# EAGLE schematic mod_panel_voltage (EAGLE 8.4.1)
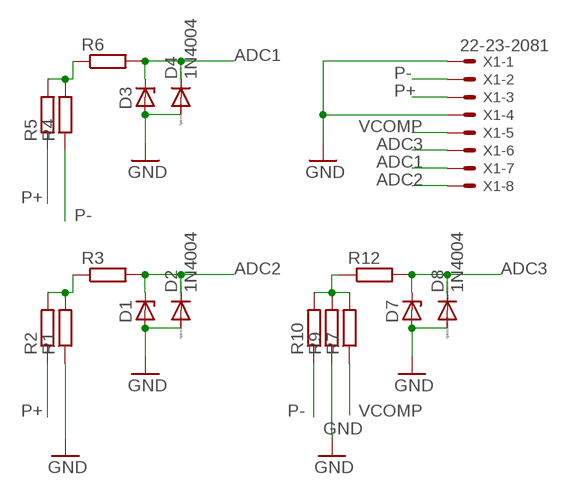
[diagram p0: schematic, sheet 1]

## Parts
D1  ZENER-DIODEDO34-7  [DO34Z7]
D2  1N4004  [DO41-10]
D3  ZENER-DIODEDO34-7  [DO34Z7]
D4  1N4004  [DO41-10]
D7  ZENER-DIODEDO34-7  [DO34Z7]
D8  1N4004  [DO41-10]
R1  R-EU_0204/5  [0204/5]
R2  R-EU_0204/5  [0204/5]
R3  R-EU_0204/5  [0204/5]
R4  R-EU_0204/5  [0204/5]
R5  R-EU_0204/5  [0204/5]
R6  R-EU_0204/5  [0204/5]
R7  R-EU_0204/5  [0204/5]
R9  R-EU_0204/5  [0204/5]
R10  R-EU_0204/5  [0204/5]
R12  R-EU_0204/5  [0204/5]
X1  22-23-2081  [22-23-2081]

## Nets
ADC1: D3.C D4.C R6.2 X1.7
ADC2: D1.C D2.C R3.2 X1.8
ADC3: D7.C D8.C R12.2 X1.6
GND: D1.A D2.A D3.A D4.A D7.A D8.A R1.1 R9.1 X1.1 X1.4
N$2: R7.2 R9.2 R10.2 R12.1
N$5: R1.2 R2.2 R3.1
N$9: R4.2 R5.2 R6.1
P+: R2.1 R5.1 X1.3
P-: R4.1 R10.1 X1.2
VCOMP: R7.1 X1.5

## Library data of the parts
D1 D3 D7 = diode:ZENER-DIODE: Z-Diode
D2 D4 D8 = diode:1N4004: DIODE general purpose rectifier, 1 A
R1-R7 R9 R10 R12 = resistor:R-EU_: RESISTOR, European symbol
X1 = con-molex:22-23-2081: .100" (2.54mm) Center Header - 8 Pin; MF: MOLEX; MPN: 22-23-2081; OC_FARNELL: 1756826; OC_NEWARK: 01C7592